# EasyEDA Pro project ReuseBlock_esp32_on_connector_2024-12-01.epro

# Schematic esp32_on_connector
Board Name: Board2; Create Date: 2024-11-30; Page Name: P1; Project Name: new pcb design; Schematic Name: Schematic2; Update Date: 2024-12-01; Company: EasyEDA.com; Drawn: EasyEDA; Page Size: A4; Part Number: JLCPCB-002; Reviewed: EasyEDA; Version: V0.1
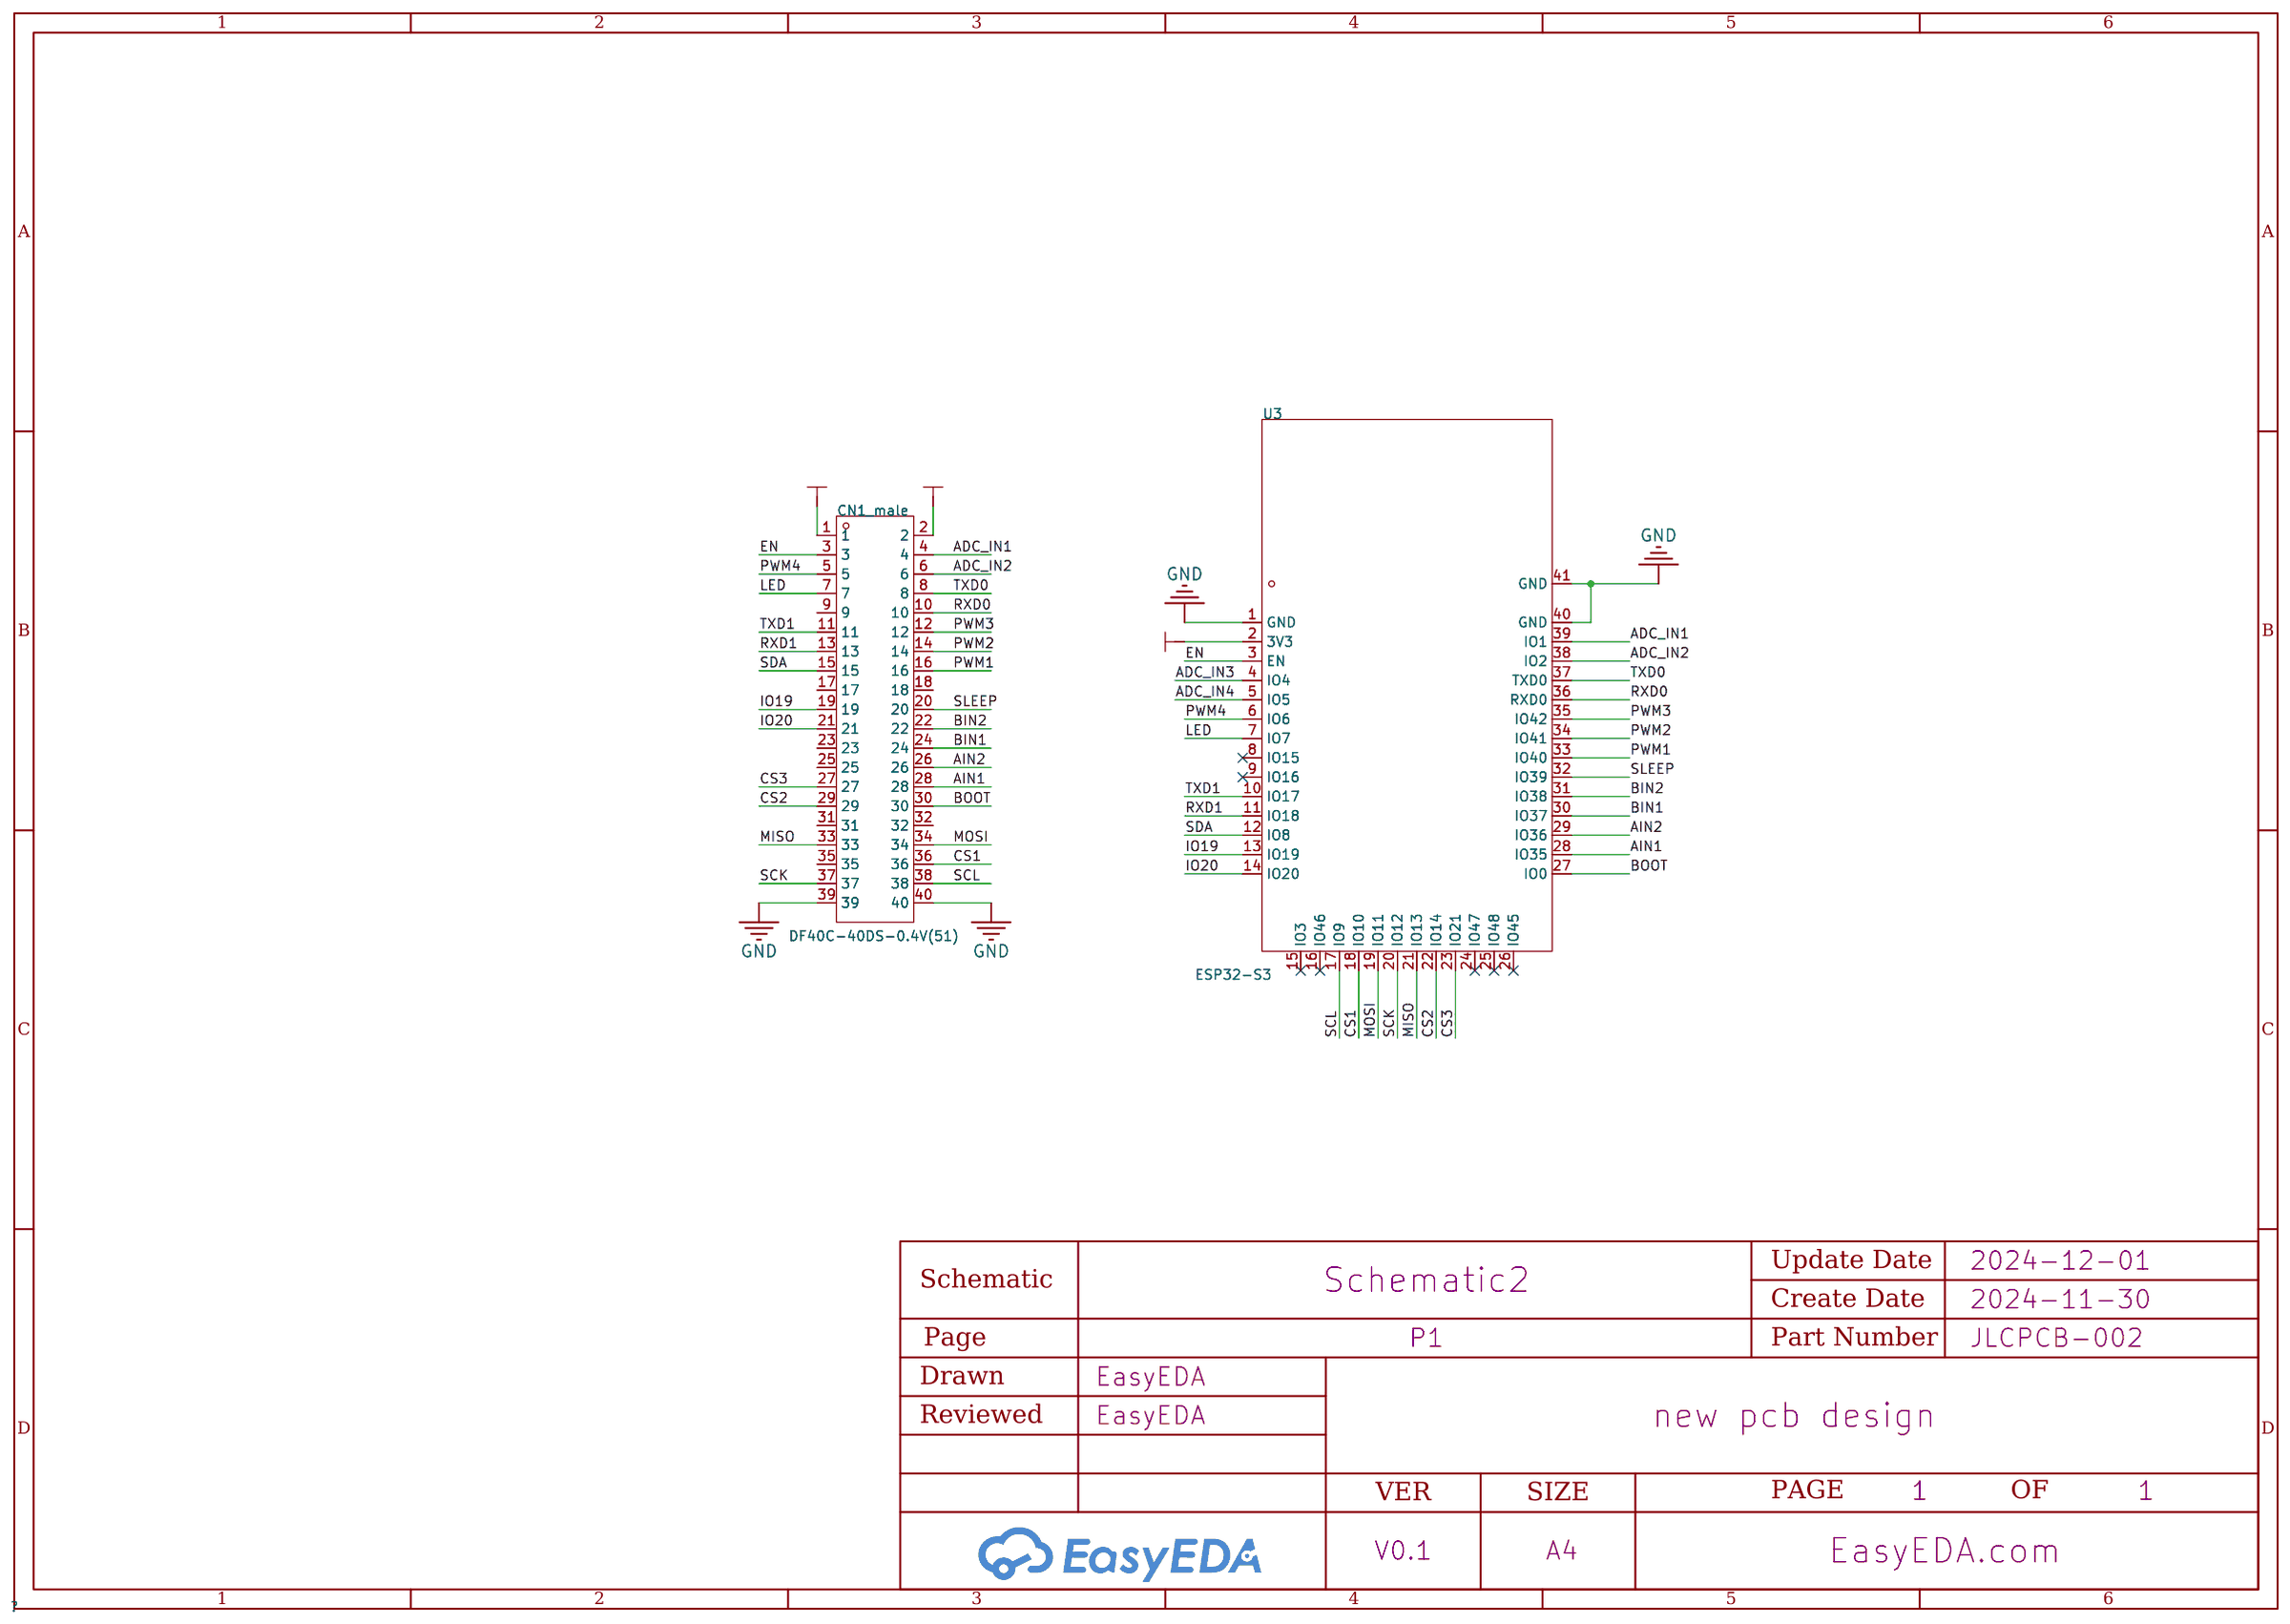
[diagram p0: schematic sheet]

## Parts
CN1_male  DF40C-40DS-0.4V(51)  [CONN-SMD_DF40C-40DS-0.4V51]
U3  ESP32-S3  [WIRELM-SMD_ESP32-S3-WROOM-1]

## Library data of the parts
CN1_male = DF40C-40DS-0.4V(51): Number of Pins:- Pitch:0.4mm Gender:Female Mounting Style:Brick nogging Number of Rows:2 Current Rating (Max):300mA Contact Plating:Gold Operating Temperature Range:-35℃~+85℃ Operating Temperature Range:-35℃~+85℃; LCSC Part Name: 间距:0.4mm 母 立贴; Supplier Part: C424644; Manufacturer: HRS(广濑); Supplier Footprint: SMD,P=0.4mm; JLCPCB Part Class: Extended Part; Datasheet: https://atta.szlcsc.com/upload/public/pdf/source/20200930/C424644_CB410DE97904F448B05F53B6B32B0FBB.pdf; Supplier: LCSC; Pitch: 0.4mm; Gender: Female; Mounting Style: Brick nogging; Number of Rows: 2; Current Rating (Max): 300mA; Contact Plating: Gold; Operating Temperature Range: -35℃~+85℃
U3 = ESP32-S3-WROOM-1-N8R2: Core Processor:ESP32-S3 Chip Support Interface:I2C；GPIO；SPI；PWM；ADC；UART；USB；I2S Frequency:2.4GHz; LCSC Part Name: 通用型Wi-Fi+低功耗蓝牙MCU模组; Supplier Part: C2913204; Manufacturer: ESPRESSIF(乐鑫); Supplier Footprint: SMD,18x25.5mm; JLCPCB Part Class: Extended Part; Datasheet: https://atta.szlcsc.com/upload/public/pdf/source/20241030/6A412B13087E1327DF6279F5735253CA.pdf; Supplier: LCSC; Core Processor: ESP32-S3 Chip; Support Interface: I2C；GPIO；SPI；PWM；ADC；UART；USB；I2S

## Nets
GND: CN1_male.39 CN1_male.40 U3.1(GND) U3.40(GND) U3.41(GND)
VCC_3V3: CN1_male.1 CN1_male.2 U3.2(3V3)
ADC_IN1: CN1_male.4 U3.39(IO1)
ADC_IN2: CN1_male.6 U3.38(IO2)
ADC_IN3: U3.4(IO4)
ADC_IN4: U3.5(IO5)
AIN1: CN1_male.28 U3.28(IO35)
AIN2: CN1_male.26 U3.29(IO36)
BIN1: CN1_male.24 U3.30(IO37)
BIN2: CN1_male.22 U3.31(IO38)
BOOT: CN1_male.30 U3.27(IO0)
CS1: CN1_male.36 U3.18(IO10)
CS2: CN1_male.29 U3.22(IO14)
CS3: CN1_male.27 U3.23(IO21)
EN: CN1_male.3 U3.3(EN)
IO19: CN1_male.19 U3.13(IO19)
IO20: CN1_male.21 U3.14(IO20)
LED: CN1_male.7 U3.7(IO7)
MISO: CN1_male.33 U3.21(IO13)
MOSI: CN1_male.34 U3.19(IO11)
PWM1: CN1_male.16 U3.33(IO40)
PWM2: CN1_male.14 U3.34(IO41)
PWM3: CN1_male.12 U3.35(IO42)
PWM4: CN1_male.5 U3.6(IO6)
RXD0: CN1_male.10 U3.36(RXD0)
RXD1: CN1_male.13 U3.11(IO18)
SCK: CN1_male.37 U3.20(IO12)
SCL: CN1_male.38 U3.17(IO9)
SDA: CN1_male.15 U3.12(IO8)
SLEEP: CN1_male.20 U3.32(IO39)
TXD0: CN1_male.8 U3.37(TXD0)
TXD1: CN1_male.11 U3.10(IO17)

Not connected (* = marked no-connect by the designer): CN1_male 9 17 18 23 25 31 32 35; U3 8(IO15)* 9(IO16)* 15(IO3)* 16(IO46)* 24(IO47)* 25(IO48)* 26(IO45)*

# Board esp32_on_connector
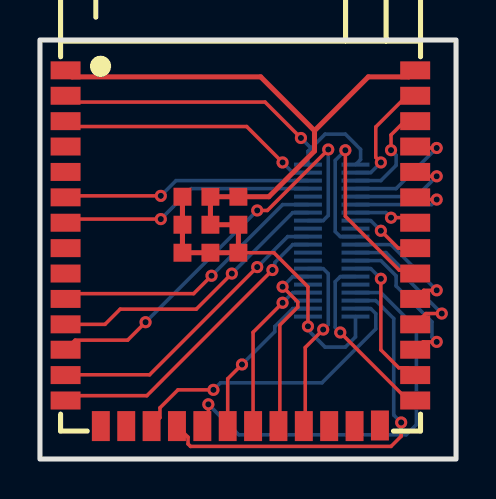
[diagram p1: board, top side]
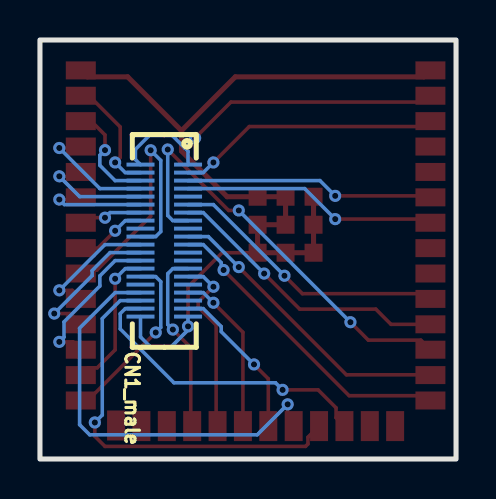
[diagram p2: board, bottom side, seen from below]

Outline 20.83 x 20.95 mm; copper layers: Top Layer, Bottom Layer. Coordinates in mm from the lower left corner of the outline.
Outline path: rectangle 0,20.95 20.83,0
Stack: Top Layer 0.035mm / Dielectric1 1.51mm FR4 er 4.5 / Bottom Layer 0.035mm

## Design rules (mm)
template: JLCPCB Capability(Two Layers Board)
spacing copperThickness1oz (default): track to track 0.102, other pairs 0.152 to 0.3
spacing copperThickness2oz: track to track 0.203, other pairs 0.152 to 0.3
track width copperThickness1oz (default): min 0.127, default 0.254, max 2.54
track width copperThickness2oz: min 0.203, default 0.254, max 2.54
differential pair differentialPair (default): width min 0.127, default 0.254, max 2.54; gap min 0.152, default 0.152
via viaSize (default): diameter min 0.5, default 0.61, max 10; hole min 0.3, default 0.305, max 6.3

## Placement (name value [footprint] x y rotation side)
CN1_male  DF40C-40DS-0.4V(51)  [CONN-SMD_DF40C-40DS-0.4V51]  14.6 10.92 90 bottom
U3  ESP32-S3  [WIRELM-SMD_ESP32-S3-WROOM-1]  10.03 10.54 0 top

## Footprints (pads in the part's own frame, mm; a bottom-side part is the same pattern mirrored in y, then rotated)
CONN-SMD_DF40C-40DS-0.4V51
  rect 0.2x1.4 smd: 1(3.8,-1.19) 2(3.8,1.19) 3(3.4,-1.19) 4(3.4,1.19) 5(3,-1.19) 6(3,1.19) 7(2.6,-1.19) 8(2.6,1.19) 9(2.2,-1.19) 10(2.2,1.19) 11(1.8,-1.19) 12(1.8,1.19) 13(1.4,-1.19) 14(1.4,1.19) 15(1,-1.19) 16(1,1.19) 17(0.6,-1.19) 18(0.6,1.19) 19(0.2,-1.19) 20(0.2,1.19) 21(-0.2,-1.19) 22(-0.2,1.19) 23(-0.6,-1.19) 24(-0.6,1.19) 25(-1,-1.19) 26(-1,1.19) 27(-1.4,-1.19) 28(-1.4,1.19) 29(-1.8,-1.19) 30(-1.8,1.19) 31(-2.2,-1.19) 32(-2.2,1.19) 33(-2.6,-1.19) 34(-2.6,1.19) 35(-3,-1.19) 36(-3,1.19) 37(-3.4,-1.19) 38(-3.4,1.19) 39(-3.8,-1.19) 40(-3.8,1.19)
WIRELM-SMD_ESP32-S3-WROOM-1
  rect 1.5x0.9 smd: 1(-8.75,8.895) 2(-8.75,7.625) 3(-8.75,6.355) 4(-8.75,5.085) 5(-8.75,3.815) 6(-8.75,2.545) 7(-8.75,1.275) 8(-8.75,0.005) 9(-8.75,-1.265) 10(-8.75,-2.535) 11(-8.75,-3.805) 12(-8.75,-5.075) 13(-8.75,-6.345) 14(-8.75,-7.615) 27(8.75,-7.615) 28(8.75,-6.345) 29(8.75,-5.075) 30(8.75,-3.805) 31(8.75,-2.535) 32(8.75,-1.265) 33(8.75,0.005) 34(8.75,1.275) 35(8.75,2.545) 36(8.75,3.815) 37(8.75,5.085) 38(8.75,6.355) 39(8.75,7.625) 40(8.75,8.895)
  rect 0.9x1.5 smd: 15(-6.985,-8.895) 16(-5.715,-8.895) 17(-4.445,-8.895) 18(-3.175,-8.895) 19(-1.905,-8.895) 20(-0.635,-8.895) 21(0.635,-8.895) 22(1.905,-8.895) 23(3.175,-8.895) 24(4.445,-8.895) 25(5.715,-8.895) 26(6.985,-8.865)
  rect 0.9x0.9 smd: 41(-2.9,2.575) 41(-2.9,1.175) 41(-2.9,-0.225) 41(-1.5,2.575) 41(-1.5,1.175) 41(-1.5,-0.225) 41(-0.1,2.575) 41(-0.1,1.175) 41(-0.1,-0.225)

## Nets
As in the schematic.

Pads without a net: CN1_male 9 17 18 23 25 31 32 35; U3 8 9 15 16 24 25 26

## Via types
v1: diameter 0.61, hole 0.305, Top Layer to Bottom Layer, 32 vias

## Routing (per net, layer and track width the routed paths; a pad name or vN(x,y) marks a point on that pad's centre or on a via; arc(x,y) is an arc through that point)
GND: length 47.8
  Top Layer w0.18: v1(13.41,6.63) 13.41,8.61 11.71,10.32 U3.41
  Top Layer w0.254: U3.40 18.46,19.11 16.44,19.11 13.74,16.42 ; 13.74,16.42 13.74,15.4 11.46,13.12 U3.41 U3.41 U3.41 U3.41 U3.41 U3.41 U3.41 U3.41 U3.41 ; 13.74,16.42 11.05,19.11 1.61,19.11 U3.1
  Bottom Layer w0.18: CN1_male.39 13.41,6.45 14.27,5.6 15.29,5.6 15.79,6.11 CN1_male.40
VCC_3V3: length 18.2
  Top Layer w0.18: U3.2 1.6,17.85 11.27,17.85 v1(13.06,16.05)
  Bottom Layer w0.18: 13.41,14.72 13.41,15.39 13.57,15.55 ; 13.57,15.55 v1(13.06,16.05) ; 13.57,15.55 14.27,16.25 15.29,16.25 16.05,15.48 16.05,14.98 15.79,14.72
ADC_IN1: length 6
  Top Layer w0.18: v1(17.06,14.83) 16.81,15.08 16.81,16.61 18.37,18.17 U3.39
  Bottom Layer w0.18: v1(17.06,14.83) 16.56,14.32 CN1_male.4
ADC_IN2: length 5.5
  Top Layer w0.18: U3.38 18.26,16.9 17.57,16.21 v1(17.57,15.45)
  Bottom Layer w0.18: v1(17.57,15.45) 17.83,15.19 17.83,14.68 17.06,13.92 CN1_male.6
AIN1: length 7.3
  Top Layer w0.18: v1(17.06,9.01) 17.06,5.46 17.96,4.56 18.42,4.56 U3.28
  Bottom Layer w0.18: v1(17.06,9.01) 16.56,9.52 15.79,9.52
AIN2: length 7.7
  Top Layer w0.18: v1(19.86,5.86) 19.17,5.86 18.78,5.47
  Bottom Layer w0.18: CN1_male.26 17.06,9.92 17.83,9.16 17.83,8.65 19.62,6.86 19.62,6.09 v1(19.86,5.86)
BIN1: length 7.3
  Top Layer w0.18: v1(20.11,7.27) 19.32,7.27 U3.30
  Bottom Layer w0.18: CN1_male.24 17.32,10.32 18.22,9.42 18.22,9.17 v1(20.11,7.27)
BIN2: length 6.3
  Top Layer w0.18: U3.31 19.21,8.44 v1(19.86,8.44)
  Bottom Layer w0.18: 15.79,10.72 17.57,10.72 v1(19.86,8.44)
BOOT: length 8.9
  Top Layer w0.18: U3.27 18.44,2.93 v1(15.03,6.33)
  Bottom Layer w0.18: CN1_male.30 15.03,9.12 14.78,8.87 14.78,6.58 v1(15.03,6.33)
CS1: length 20.4
  Top Layer w0.18: U3.18 7.41,1.09 7.41,0.75 7.54,0.63 17.57,0.63 18.08,1.14 v1(18.08,1.83)
  Bottom Layer w0.18: v1(18.08,1.83) 17.71,2.2 17.71,7.02 16.81,7.92 CN1_male.36
CS2: length 9.2
  Top Layer w0.18: U3.22 12.01,1.72 12.01,6.7 12.91,7.6 12.91,7.85 v1(12.14,8.61)
  Bottom Layer w0.18: CN1_male.29 12.65,9.12 v1(12.14,8.61)
CS3: length 9.2
  Top Layer w0.18: v1(14.18,6.47) 13.28,5.58 13.28,1.72 U3.23
  Bottom Layer w0.18: v1(14.18,6.47) 14.43,6.73 14.43,9.27 14.18,9.52 13.41,9.52
EN: length 13.2
  Top Layer w0.18: U3.3 1.55,16.63 10.35,16.63 v1(12.14,14.83)
  Bottom Layer w0.18: CN1_male.3 12.65,14.32 v1(12.14,14.83)
IO19: length 15
  Top Layer w0.18: U3.13 1.3,4.21 5.49,4.21 v1(10.88,9.6)
  Bottom Layer w0.18: v1(10.88,9.6) 12.4,11.12 CN1_male.19
IO20: length 15.5
  Top Layer w0.18: U3.14 1.52,3.17 5.35,3.17 v1(11.64,9.45)
  Bottom Layer w0.18: 13.41,10.72 12.65,10.72 11.75,9.82 11.75,9.57 v1(11.64,9.45)
LED: length 12.8
  Top Layer w0.18: v1(6.05,12) 1.47,12 U3.7
  Bottom Layer w0.18: 13.41,13.52 7.57,13.52 v1(6.05,12)
MISO: length 8.3
  Top Layer w0.18: v1(12.14,7.81) 10.67,6.34 U3.21
  Bottom Layer w0.18: CN1_male.33 12.65,8.32 v1(12.14,7.81)
MOSI: length 21.1
  Top Layer w0.18: v1(8.43,2.73) 8.43,1.95 U3.19
  Bottom Layer w0.18: CN1_male.34 17.06,8.32 18.84,6.54 18.84,1.72 18.33,1.21 9.95,1.21 v1(8.43,2.73)
PWM1: length 3.6
  Top Layer w0.18: v1(17.06,11.41) 17.93,10.55 18.78,10.55
  Bottom Layer w0.18: CN1_male.16 16.56,11.92 v1(17.06,11.41)
PWM2: length 3.2
  Top Layer w0.18: v1(17.57,12.07) 18.53,12.07 U3.34
  Bottom Layer w0.18: v1(17.57,12.07) 17.32,12.32 CN1_male.14
PWM3: length 5.3
  Top Layer w0.18: U3.35 18.89,12.98 v1(19.86,12.98)
  Bottom Layer w0.18: 15.79,12.72 19.6,12.72 v1(19.86,12.98)
PWM4: length 12.5
  Top Layer w0.18: v1(6.05,13.16) 1.36,13.16 U3.6
  Bottom Layer w0.18: CN1_male.5 6.81,13.92 v1(6.05,13.16)
RXD0: length 5.7
  Top Layer w0.18: v1(19.86,14.14) 19,14.14 U3.36
  Bottom Layer w0.18: CN1_male.10 18.84,13.12 v1(19.86,14.14)
RXD1: length 14.4
  Top Layer w0.18: v1(9.6,9.27) 7.83,7.5 4.02,7.5 3.26,6.74 U3.11
  Bottom Layer w0.18: v1(9.6,9.27) 12.65,12.32 CN1_male.13
SCK: length 8
  Top Layer w0.18: U3.20 9.4,4.01 v1(10.11,4.73)
  Bottom Layer w0.18: v1(10.11,4.73) 11.75,6.37 11.75,6.62 12.65,7.52 13.41,7.52
SCL: length 15.4
  Top Layer w0.18: v1(8.68,3.46) 6.91,3.46 6.01,2.56 6.01,2.06 U3.17
  Bottom Layer w0.18: v1(8.68,3.46) 9.04,3.81 14.12,3.81 16.81,6.51 16.81,7.27 16.56,7.52 15.79,7.52
SDA: length 21.7
  Top Layer w0.18: v1(14.43,15.48) 11.38,12.43 v1(10.88,12.43) ; v1(5.29,6.84) 4.39,5.94 1.76,5.94 1.28,5.47
  Bottom Layer w0.18: CN1_male.15 14.18,11.92 14.43,12.18 v1(14.43,15.48) ; v1(10.88,12.43) v1(5.29,6.84)
SLEEP: length 13.4
  Top Layer w0.18: U3.32 18.61,9.44 17.98,9.44 15.29,12.14 v1(15.29,15.44)
  Bottom Layer w0.18: CN1_male.20 15.03,11.12 14.78,11.38 14.78,14.93 v1(15.29,15.44)
TXD0: length 6
  Top Layer w0.18: 18.78,15.63 18.85,15.55 v1(19.86,15.55)
  Bottom Layer w0.18: v1(19.86,15.55) 17.83,13.52 15.79,13.52
TXD1: length 14.1
  Top Layer w0.18: v1(8.59,9.17) 7.69,8.27 1.54,8.27 U3.10
  Bottom Layer w0.18: v1(8.59,9.17) 12.14,12.72 13.41,12.72
